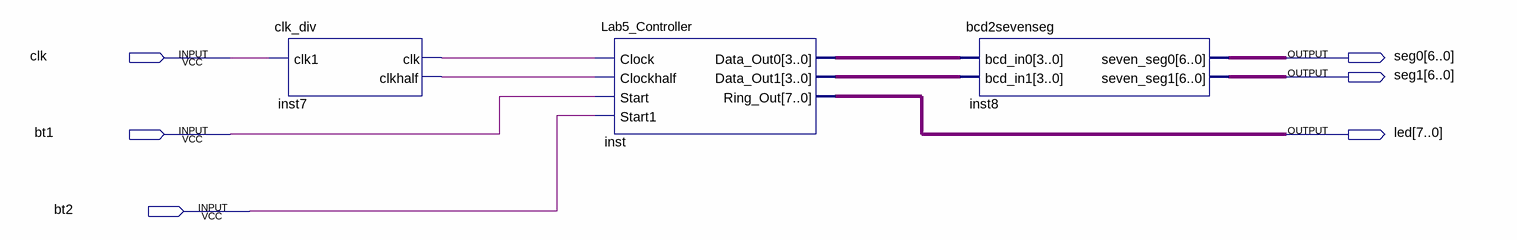
[diagram p0: schematic sheet]
// Quartus schematic Lab5.bdf as structural Verilog: 3 symbols, 6 pins
module Lab5 (
  input  clk,
  input  bt1,
  input  bt2,
  output [6:0] seg0,
  output [6:0] seg1,
  output [7:0] led
);

  wire inst7_clk, inst7_clkhalf;
  wire [3:0] inst_data_out0, inst_data_out1;

  clk_div inst7 (.clk1(clk), .clk(inst7_clk), .clkhalf(inst7_clkhalf));
  Lab5_Controller inst (
    .Clock(inst7_clk), .Clockhalf(inst7_clkhalf), .Start(bt1), .Start1(bt2), .Data_Out0(inst_data_out0),
    .Data_Out1(inst_data_out1), .Ring_Out(led));
  bcd2sevenseg inst8 (.bcd_in0(inst_data_out0), .bcd_in1(inst_data_out1), .seven_seg0(seg0), .seven_seg1(seg1));
endmodule
